# Altium project FluidGuard(Tx).PrjPcb (part 1 of 2)
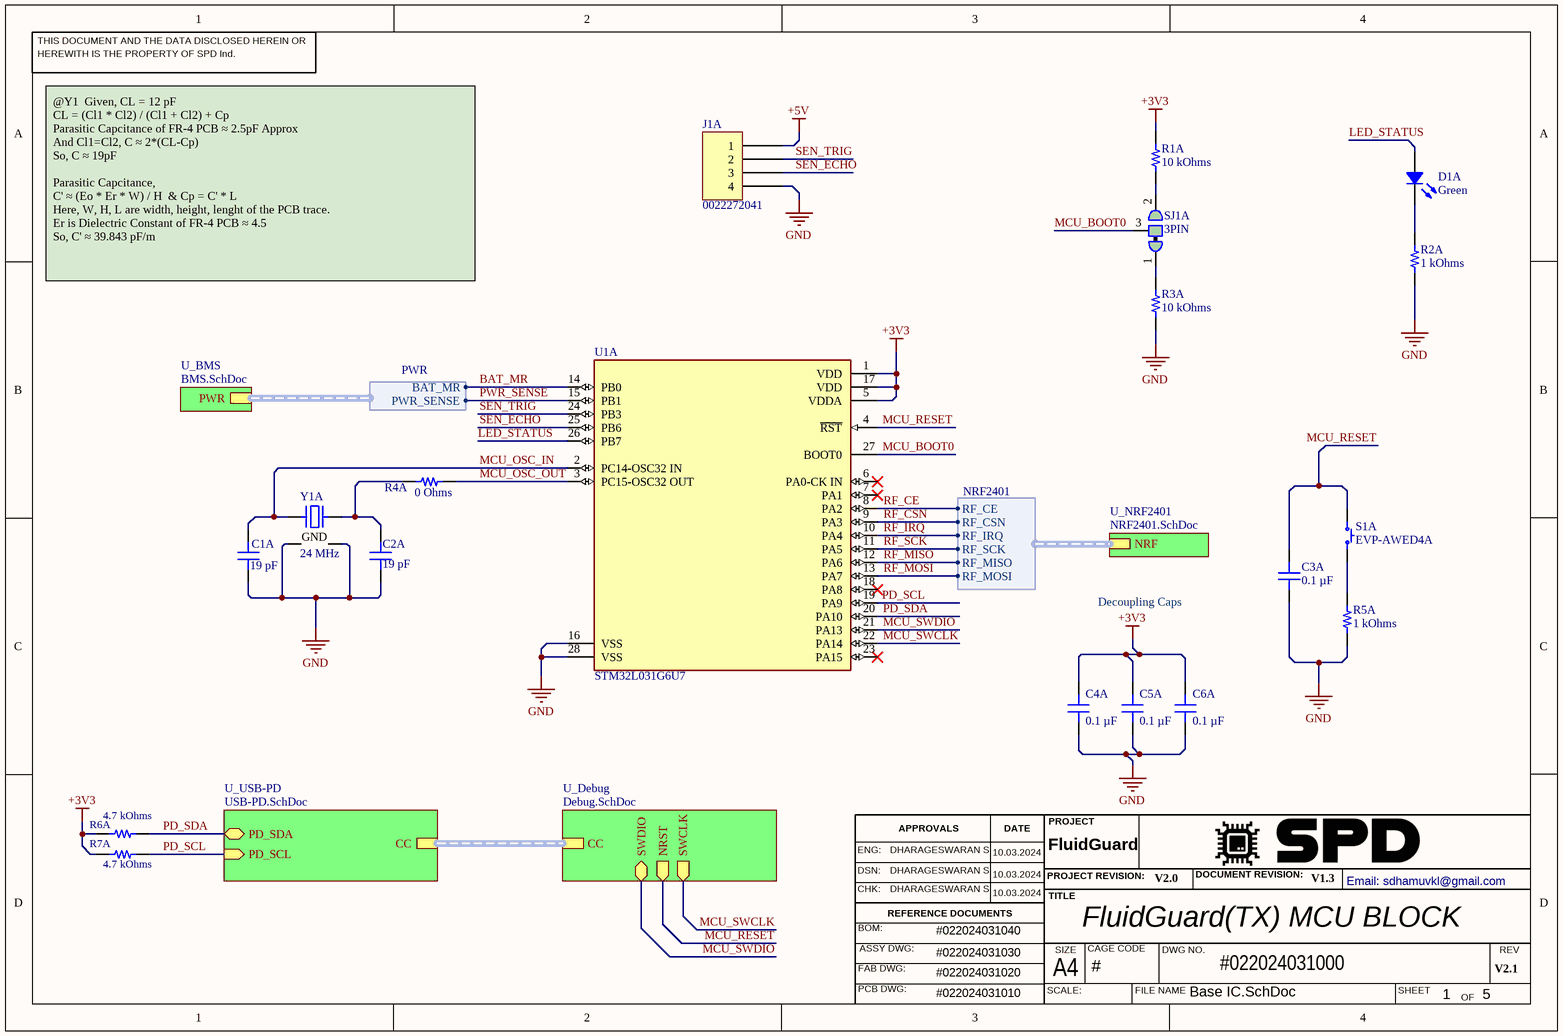
[diagram p0: Base IC.SchDoc]
CAGE_CODE: #; Date: 10.03.2024; DOC_NO_ASSY_DWG: #022024031030; DOC_NO_BOM: #022024031040; DOC_NO_FAB_DWG: #022024031020; DOC_NO_SCH_DWG: #022024031000; DocumentRevision: V1.3; PCB_DWG_NO: #022024031010; Project: FluidGuard; ProjectRevision: V2.0; Revision: V2.1
5 sheets, 115 parts. Net scope: hierarchical (ports join the sheet entries above them; power ports are global).
Board file: FluidGuard(TX).PcbDoc
Sheets:
  Base IC.SchDoc
    U_Debug = Debug.SchDoc
    U_NRF2401 = NRF2401.SchDoc
    U_USB-PD = USB-PD.SchDoc
    U_BMS = BMS.SchDoc

## Sheet Base IC.SchDoc: FluidGuard(TX) MCU BLOCK
size A4; SheetNumber: 1; SheetTotal: 5

### Parts
C1A  19 pF  [CAP 0402_1005]
C2A  19 pF  [CAP 0402_1005]
C3A  0.1 µF  [CAP 0402_1005]
C4A  0.1 µF  [CAP 0402_1005]
C5A  0.1 µF  [CAP 0402_1005]
C6A  0.1 µF  [CAP 0402_1005]
D1A  Green  [LED 0402_1005 GREEN]
J1A  0022272041  [MOLEX KK 0022272041]
R1A  10 kOhms  [RES 0402_1005]
R2A  1 kOhms  [RES 0402_1005]
R3A  10 kOhms  [RES 0402_1005]
R4A  0 Ohms  [RES 0402_1005]
R5A  1 kOhms  [RES 0402_1005]
R6A  4.7 kOhms  [RES 0402_1005]
R7A  4.7 kOhms  [RES 0402_1005]
S1A  EVP-AWED4A  [PANASONIC EVPAW]
SJ1A  3PIN  [Rounded Jumper Joint 3-pin]
U1A  STM32L031G6U7  [FP-UFQFPN28-A0B0-MFG]
Y1A  24 MHz  [EPSON TSX-3225]

### Sub-sheets
U_BMS = BMS.SchDoc: PWR (harness PWR)
U_Debug = Debug.SchDoc: SWDIO (bidir), SWCLK (out), NRST (out), CC (harness CC)
U_NRF2401 = NRF2401.SchDoc: NRF (harness NRF2401)
U_USB-PD = USB-PD.SchDoc: PD_SDA (bidir), PD_SCL (in), CC (harness CC)

### Harnesses
NRF2401: RF_CE, RF_CSN, RF_IRQ, RF_SCK, RF_MISO, RF_MOSI
PWR: BAT_MR, PWR_SENSE

### Nets
+3V3: C4A.2 C5A.2 C6A.2 R1A.2 R6A.2 R7A.2 U1A.1(VDD) U1A.5(VDDA) U1A.17(VDD)
+5V: J1A.1
GND: C1A.1 C2A.1 C3A.1 C4A.1 C5A.1 C6A.1 J1A.4 R2A.1 R3A.1 R5A.1 U1A.16(VSS) U1A.28(VSS) Y1A.2(GND) Y1A.4(GND)
BAT_MR: U1A.14(PB0) ; sheet U_BMS/PWR.BAT_MR
LED_STATUS: D1A.1 U1A.26(PB7)
MCU_BOOT0: SJ1A.3 U1A.27(BOOT0)
MCU_OSC_IN: C1A.2 U1A.2(PC14-OSC32_IN) Y1A.1
MCU_OSC_OUT: R4A.2 U1A.3(PC15-OSC32_OUT)
MCU_RESET: C3A.2 S1A.1 U1A.4(~{RST}) ; sheet U_Debug/NRST
MCU_SWCLK: U1A.22(PA14) ; sheet U_Debug/SWCLK  [project net MCU SWCLK]
MCU_SWDIO: U1A.21(PA13) ; sheet U_Debug/SWDIO  [project net MCU SWDIO]
PD_SCL: R7A.1 U1A.19(PA9) ; sheet U_USB-PD/PD_SCL
PD_SDA: R6A.1 U1A.20(PA10) ; sheet U_USB-PD/PD_SDA
PWR_SENSE: U1A.15(PB1) ; sheet U_BMS/PWR.PWR_SENSE
RF_CE: U1A.8(PA2) ; sheet U_NRF2401/NRF.RF_CE
RF_CSN: U1A.9(PA3) ; sheet U_NRF2401/NRF.RF_CSN
RF_IRQ: U1A.10(PA4) ; sheet U_NRF2401/NRF.RF_IRQ
RF_MISO: U1A.12(PA6) ; sheet U_NRF2401/NRF.RF_MISO
RF_MOSI: U1A.13(PA7) ; sheet U_NRF2401/NRF.RF_MOSI
RF_SCK: U1A.11(PA5) ; sheet U_NRF2401/NRF.RF_SCK
SEN_ECHO: J1A.3 U1A.25(PB6)
SEN_TRIG: J1A.2 U1A.24(PB3)
NetC2A_2: C2A.2 R4A.1 Y1A.3
NetD1A_2: D1A.2 R2A.2
NetR1A_1: R1A.1 SJ1A.2
NetR3A_2: R3A.2 SJ1A.1
NetR5A_2: R5A.2 S1A.2

Not connected (* = marked no-connect by the designer): U1A 6(PA0-CK_IN)* 7(PA1)* 18(PA8)* 23(PA15)*

### Buses and harness runs
harness sheet U_Debug/CC = sheet U_USB-PD/CC

### Notes on the sheet
- @Y1  Given, CL = 12 pF
  CL = (Cl1 * Cl2) / (Cl1 + Cl2) + Cp
  Parasitic Capcitance of FR-4 PCB ≈ 2.5pF Approx
  And Cl1=Cl2, C ≈ 2*(CL-Cp)
  So, C ≈ 19pF
  Parasitic Capcitance,
  C' ≈ (Eo * Er * W) / H  & Cp = C' * L
  Here, W, H, L are width, height, lenght of the PCB trace.
  Er is Dielectric Constant of FR-4 PCB ≈ 4.5
  So, C' ≈ 39.843 pF/m
- Decoupling Caps
- THIS DOCUMENT AND THE DATA DISCLOSED HEREIN OR
- HEREWITH IS THE PROPERTY OF SPD Ind.
- ENG:
- DHARAGESWARAN S
- APPROVALS
- DATE
- PROJECT
- DSN:
- CHK:
- REFERENCE DOCUMENTS
- PROJECT REVISION:
- TITLE
- DOCUMENT REVISION:
- Email: sdhamuvkl@gmail.com <https://github.com/DhamuVkl>
- BOM:
- FAB DWG:
- PCB DWG:
- ASSY DWG:
- SCALE:
- A4
- SIZE
- CAGE CODE
- FILE NAME
- DWG NO.
- SHEET
- REV
- OF

### Library data of the parts
C1A C2A = GJM1555C1H190GB01D: CAP CER 19PF 50VDC 0402 C0G 2%; Manufacturer: Murata Electronics; id: 5279; Temperature Coefficient: C0G, NP0; Voltage - Rated: 50V; Part Number: GJM1555C1H190GB01D; Value: 19 pF; Supplier Part Number 1: 490-GJM1555C1H190GB01DCT-ND; ComponentLink2Description: DigiKey Link; Features: High Q, Low Loss; ComponentLink1URL: https://search.murata.co.jp/Ceramy/image/img/A01X/G101/ENG/GJM1555C1H190GB01-01A.pdf; PartId: 41775; Tolerance: ±2%; Supplier 1: DigiKey; Series: GJM; LastUpdated: 2023-01-03T20:03:22.137; Part Status: Active; Capacitance: 19 pF; Device Package: 0402 (1005 Metric); Thickness (Max): 0.022" (0.55mm); Minimum Order: 1; Packaging: TapeAndReel; Applications: RF, Microwave, High Frequency; Package / Case: 0402 (1005 Metric); ComponentLink1Description: Datasheet; Price: 0.02; ComponentLink2URL: https://www.digikey.com/en/products/detail/murata-electronics/GJM1555C1H190GB01D/16033843; Lifecycle Status: Active; Operating Temperature: -55°C ~ 125°C; Size / Dimension: 0.039" L x 0.020" W (1.00mm x 0.50mm); Mounting Type: Surface Mount, MLCC
C3A C4A C5A C6A = CL05B104KP5VPNC: CAP CER 100NF 10V X7R 0402; Manufacturer: Samsung Electro-Mechanics; id: 7736; Tolerance: ±10%; Part Number: CL05B104KP5VPNC; Value: 0.1 µF; Temperature Coefficient: X7R; Supplier Part Number 1: 1276-CL05B104KP5VPNCCT-ND; ComponentLink2Description: DigiKey Link; ComponentLink1URL: https://mm.digikey.com/Volume0/opasdata/d220001/medias/docus/5458/CL05B104KP5VPNC_Spec.pdf; PartId: 56690; Supplier 1: DigiKey; Series: CL; LastUpdated: 2023-11-05T20:02:55.743; Capacitance: 0.1 µF; Device Package: 0402 (1005 Metric); Ratings: AEC-Q200; Thickness (Max): 0.022" (0.55mm); Voltage - Rated: 10V; Minimum Order: 1; Packaging: TapeAndReel; Applications: Automotive; Package / Case: 0402 (1005 Metric); ComponentLink1Description: Datasheet; Price: 0.01; ComponentLink2URL: https://www.digikey.com/en/products/detail/samsung-electro-mechanics/CL05B104KP5VPNC/20498482; Lifecycle Status: Active; Operating Temperature: -55°C ~ 125°C; Size / Dimension: 0.039" L x 0.020" W (1.00mm x 0.50mm); Mounting Type: Surface Mount, MLCC
D1A = HSMG-C280: LED GREEN DIFFUSED 0402 SMD; Manufacturer: Broadcom Limited; id: 697; Lens Color: White; Wavelength - Peak: 570nm; Lens Style: Rectangle with Flat Top; Viewing Angle: 130°; Lens Size: 1.00mm x 0.50mm; Configuration: Standard; Wavelength - Dominant: 572nm; Voltage - Forward (Vf) (Typ): 2.2V; Current - Test: 20mA; Millicandela Rating: 15mcd; Part Number: HSMG-C280; Supplier Part Number 1: 516-3066-1-ND; Lens Transparency: Diffused; Supplier Device Package: 0402; ComponentLink1Description: Datasheet; Color: Green; ComponentLink2URL: https://www.digikey.com/en/products/detail/broadcom-limited/HSMG-C280/1235358; ComponentLink1URL: https://docs.broadcom.com/docs/AV02-0602EN; Supplier 1: DigiKey; Series: -; Height (Max): 0.40mm; Part Status: Active; ComponentLink2Description: DigiKey Link; Device Package: 0402 (1005 Metric); Packaging: TapeAndReel; Minimum Order: 1; Package / Case: 0402 (1005 Metric); PartId: 697; Lifecycle Status: Active; LastUpdated: 2023-01-02T20:56:26.750; Value: Green; Size / Dimension: 1.00mm L x 0.50mm W; Mounting Type: Surface Mount; Price: 0.08
J1A = 0022272041: CONN HEADER VERT 4POS 2.54MM; Manufacturer: Molex; id: 78; Style: Board to Cable/Wire; Contact Length - Mating: 0.295" (7.49mm); Pitch - Mating: 0.100" (2.54mm); Number Of Positions: 4; Number Of Positions Loaded: All; Shrouding: Shrouded - 1 Wall; Material Flammability Rating: UL94 V-0; Overall Contact Length: 0.560" (14.22mm); Contact Length - Post: 0.140" (3.56mm); Part Number: 0022272041; Supplier Part Number 1: WM4113-ND; Contact Shape: Square; Termination: Solder; ComponentLink1Description: Datasheet; Connector Type: Header; Contact Material: Brass; ComponentLink2URL: http://digikey.com/product-detail/en/molex/0022272041/WM4113-ND/1130579; Contact Finish - Mating: Tin; ComponentLink1URL: https://www.molex.com/pdm_docs/sd/022272041_sd.pdf; Fastening Type: Friction Lock; Supplier 1: DigiKey; Number Of Rows: 1; Series: KK 6410; Part Status: Active; ComponentLink2Description: DigiKey Link; Contact Type: Male Pin; Packaging: Bulk; Insulation Height: 0.461" (11.70mm); Contact Finish - Post: Tin; Contact Finish Thickness - Mating: 100.0µin (2.54µm); Minimum Order: 1; PartId: 78; Lifecycle Status: Active; LastUpdated: 2020-01-12T23:52:05.287; Insulation Color: Natural; Mounting Type: Through Hole; Insulation Material: Polyamide (PA), Nylon; Price: 0.40
R1A R3A = AA0402FR-0710KL: RES SMD 10K OHM 1% 1/16W 0402; Manufacturer: Yageo; id: 10610; Temperature Coefficient: ±150ppm/°C; Power (Watts): 0.063W, 1/16W; Part Number: AA0402FR-0710KL; Height - Seated (Max): 0.015" (0.37mm); Supplier Part Number 1: 13-AA0402FR-0710KLCT-ND; Supplier Device Package: 0402; ComponentLink1Description: Datasheet; ComponentLink2URL: https://www.digikey.com/en/products/detail/yageo/AA0402FR-0710KL/5887729; Features: Anti-Sulfur, Automotive AEC-Q200, Moisture Resistant; ComponentLink1URL: https://www.yageo.com/upload/media/product/productsearch/datasheet/rchip/PYu-AA_51_RoHS_L_3.pdf; Composition: Thick Film; Tolerance: ±1%; Supplier 1: DigiKey; Series: AA; Part Status: Active; ComponentLink2Description: DigiKey Link; Device Package: 0402 (1005 Metric); Packaging: TapeAndReel; Ratings: AEC-Q200; Minimum Order: 1; Package / Case: 0402 (1005 Metric); PartId: 59190; Lifecycle Status: Active; LastUpdated: 2023-01-02T20:20:10.303; Operating Temperature: -55°C ~ 155°C; Number Of Terminations: 2; Value: 10 kOhms; Size / Dimension: 0.039" L x 0.020" W (1.00mm x 0.50mm); Price: 0.01; Resistance: 10 kOhms
R2A R5A = AA0402FR-071KL: RES SMD 1K OHM 1% 1/16W 0402; Manufacturer: Yageo; id: 10598; Temperature Coefficient: ±150ppm/°C; Power (Watts): 0.063W, 1/16W; Part Number: AA0402FR-071KL; Height - Seated (Max): 0.015" (0.37mm); Supplier Part Number 1: 13-AA0402FR-071KLCT-ND; Supplier Device Package: 0402; ComponentLink1Description: Datasheet; ComponentLink2URL: https://www.digikey.com/en/products/detail/yageo/AA0402FR-071KL/5887878; Features: Anti-Sulfur, Automotive AEC-Q200, Moisture Resistant; ComponentLink1URL: https://www.yageo.com/upload/media/product/productsearch/datasheet/rchip/PYu-AA_51_RoHS_L_3.pdf; Composition: Thick Film; Tolerance: ±1%; Supplier 1: DigiKey; Series: AA; Part Status: Active; ComponentLink2Description: DigiKey Link; Device Package: 0402 (1005 Metric); Packaging: TapeAndReel; Ratings: AEC-Q200; Minimum Order: 1; Package / Case: 0402 (1005 Metric); PartId: 59178; Lifecycle Status: Active; LastUpdated: 2023-01-02T20:20:10.210; Operating Temperature: -55°C ~ 155°C; Number Of Terminations: 2; Value: 1 kOhms; Size / Dimension: 0.039" L x 0.020" W (1.00mm x 0.50mm); Price: 0.01; Resistance: 1 kOhms
R4A = AC0402JR-070RL: RES SMD 0 OHM JUMPER 1/16W 0402; Manufacturer: Yageo; id: 9339; Power (Watts): 0.063W, 1/16W; Part Number: AC0402JR-070RL; Height - Seated (Max): 0.015" (0.37mm); Supplier Part Number 1: 311-0.0LBCT-ND; Supplier Device Package: 0402; ComponentLink1Description: Datasheet; ComponentLink2URL: https://www.digikey.com/en/products/detail/yageo/AC0402JR-070RL/2827807; Features: Automotive AEC-Q200, Moisture Resistant; ComponentLink1URL: https://www.yageo.com/upload/media/product/productsearch/datasheet/rchip/PYu-AC_51_RoHS_L_7.pdf; Composition: Thick Film; Tolerance: Jumper; Supplier 1: DigiKey; Series: AC; Part Status: Active; ComponentLink2Description: DigiKey Link; Device Package: 0402 (1005 Metric); Packaging: CutTape; Ratings: AEC-Q200; Minimum Order: 1; Package / Case: 0402 (1005 Metric); PartId: 20617; Lifecycle Status: Active; LastUpdated: 2023-01-02T20:20:32.243; Operating Temperature: -55°C ~ 155°C; Number Of Terminations: 2; Value: 0 Ohms; Size / Dimension: 0.039" L x 0.020" W (1.00mm x 0.50mm); Price: 0.01; Resistance: 0 Ohms
R6A R7A = AC0402FR-074K7L: RES SMD 4.7K OHM 1% 1/16W 0402; Manufacturer: Yageo; id: 4996; Temperature Coefficient: ±100ppm/°C; Power (Watts): 0.063W, 1/16W; Part Number: AC0402FR-074K7L; Height - Seated (Max): 0.015" (0.37mm); Supplier Part Number 1: YAG3497CT-ND; Supplier Device Package: 0402; ComponentLink1Description: Datasheet; ComponentLink2URL: https://www.digikey.com/en/products/detail/yageo/AC0402FR-074K7L/5895396; Features: Automotive AEC-Q200, Moisture Resistant; ComponentLink1URL: https://www.yageo.com/upload/media/product/productsearch/datasheet/rchip/PYu-AC_51_RoHS_L_7.pdf; Composition: Thick Film; Tolerance: ±1%; Supplier 1: DigiKey; Series: AC; Part Status: Active; ComponentLink2Description: DigiKey Link; Device Package: 0402 (1005 Metric); Packaging: CutTape; Ratings: AEC-Q200; Minimum Order: 1; Package / Case: 0402 (1005 Metric); PartId: 12051; Lifecycle Status: Active; LastUpdated: 2023-01-02T20:21:09.847; Operating Temperature: -55°C ~ 155°C; Number Of Terminations: 2; Value: 4.7 kOhms; Size / Dimension: 0.039" L x 0.020" W (1.00mm x 0.50mm); Price: 0.01; Resistance: 4.7 kOhms
S1A = EVP-AWED4A: 3.0MM X 2.0MM / 3.3N / 0.15MM ST; Manufacturer: Panasonic Electronic Components; id: 5; Switch Function: Off-Mom; Contact Rating @ Voltage: 0.02A @ 15VDC; Outline: 3.00mm x 2.00mm; Actuator Height Off Pcb, Vertical: 0.60mm; Ingress Protection: IP67 - Dust Tight, Waterproof; Actuator Orientation: Top Actuated; Actuator Type: Standard; Illumination: Non-Illuminated; Operating Force: 330gf; Circuit: SPST-NO; Part Number: EVP-AWED4A; Supplier Part Number 1: P123440CT-ND; ComponentLink1Description: Datasheet; ComponentLink2URL: https://www.digikey.com/en/products/detail/panasonic-electronic-components/EVP-AWED4A/8568275; ComponentLink1URL: https://industrial.panasonic.com/ac/cdn/e/control/switch/light-touch/catalog/sw_lt_eng_3020s.pdf; Supplier 1: DigiKey; Series: EVPAW; Part Status: Active; ComponentLink2Description: DigiKey Link; Packaging: TapeAndReel; Minimum Order: 1; Lifecycle Status: Active; LastUpdated: 2023-01-02T21:07:29.980; Termination Style: SMD (SMT) Tab; Operating Temperature: -40°C ~ 85°C; Mounting Type: Surface Mount; Price: 0.16
SJ1A = Rounded Jumper Joint 3-pin
U1A = CMP-12105-000084-1: IC MCU 32BIT 32KB FLASH 28UFQFPN; Oscillator Type: Internal; Core Architecture: ARM; Peripherals: Brown-out Detect/Reset; Interface: I2C; Watchdog Timer: Yes; Max Power Dissipation: 167mW; Max Frequency: 32MHz; Operating Supply Voltage: 3.3V; Number of Timers/Counters: 4; Max Supply Voltage: 3.6V; RAM Size: 1KB; Number of Programmable I/O: 21; Min Supply Voltage: 1.8V; Lead Free: Lead Free; Mount: Surface Mount; Min Operating Temperature: -40°C; Frequency: 32MHz; Max Operating Temperature: 105°C; Number of Pins: 28; Memory Type: FLASH; Number of I/Os: 21; Memory Size: 32KB
Y1A = TSX-3225 24.0000MF15X-AC3: CRYSTAL 24.0000MHZ 9PF SMD; Manufacturer: EPSON; id: 441; Frequency Tolerance: ±10ppm; Frequency Stability: ±15ppm; Operating Mode: Fundamental; Esr (Equivalent Series Resistance): 40 Ohms; Part Number: TSX-3225 24.0000MF15X-AC3; Height - Seated (Max): 0.024" (0.60mm); Supplier Part Number 1: SER3635CT-ND; ComponentLink1Description: Datasheet; ComponentLink2URL: https://www.digikey.com/en/products/detail/epson/TSX-3225-24-0000MF15X-AC3/1825444; ComponentLink1URL: https://support.epson.biz/td/api/doc_check.php?dl=brief_TSX-3225&lang=en; Supplier 1: DigiKey; Frequency: 24 MHz; Series: TSX-3225; Part Status: Active; Type: MHz Crystal; ComponentLink2Description: DigiKey Link; Packaging: TapeAndReel; Minimum Order: 1; Package / Case: 4-SMD, No Lead; PartId: 441; Lifecycle Status: Active; LastUpdated: 2023-01-02T20:58:19.840; Operating Temperature: -40°C ~ 85°C; Value: 24 MHz; Size / Dimension: 0.126" L x 0.098" W (3.20mm x 2.50mm); Mounting Type: Surface Mount; Price: 0.44; Load Capacitance: 9pF

## Sheet Debug.SchDoc: DEBUG PORT
size A4; SheetNumber: 5; SheetTotal: 5; DOC_NO_SCH_DWG: #022024031004
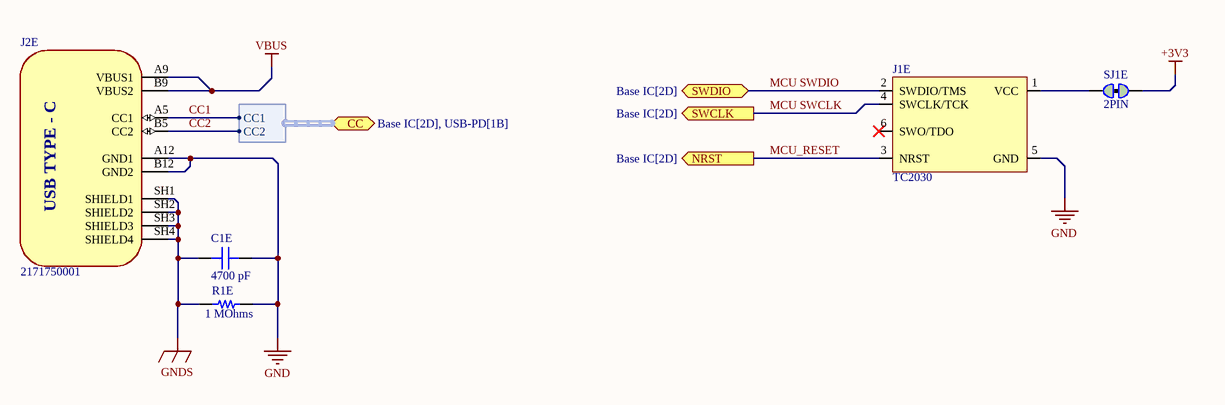
[diagram p1: Debug.SchDoc]

### Parts
C1E  4700 pF  [CAP 0402_1005]
J1E  TC2030  [TC2030-FP]  (no BOM)
J2E  2171750001  [MOLEX_2171750001]
R1E  1 MOhms  [RES 0402_1005]
SJ1E  2PIN  [Rounded Jumper Joint]

### Ports
CC (bidir, harness CC, see Base IC[2D], USB-PD[1B]), NRST (out, see Base IC[2D]), SWCLK (out, see Base IC[2D]), SWDIO (bidir, see Base IC[2D])

### Harnesses
CC: CC1, CC2

### Nets
+3V3: SJ1E.2
GND: C1E.2 J1E.5(GND) J2E.A12(GND1) J2E.B12(GND2) R1E.2
GNDS: C1E.1 J2E.SH1(SHIELD1) J2E.SH2(SHIELD2) J2E.SH3(SHIELD3) J2E.SH4(SHIELD4) R1E.1
VBUS: J2E.A9(VBUS1) J2E.B9(VBUS2)
CC1: J2E.A5(CC1) ; port CC.CC1
CC2: J2E.B5(CC2) ; port CC.CC2
MCU SWCLK: J1E.4(SWCLK/TCK) ; port SWCLK
MCU SWDIO: J1E.2(SWDIO/TMS) ; port SWDIO
MCU_RESET: J1E.3(NRST) ; port NRST
NetJ1E_1: J1E.1(VCC) SJ1E.1

Not connected (* = marked no-connect by the designer): J1E 6(SWO/TDO)*

### Notes on the sheet
- THIS DOCUMENT AND THE DATA DISCLOSED HEREIN OR
- HEREWITH IS THE PROPERTY OF SPD Ind.
- ENG:
- DHARAGESWARAN S
- APPROVALS
- DATE
- PROJECT
- DSN:
- CHK:
- REFERENCE DOCUMENTS
- PROJECT REVISION:
- TITLE
- DOCUMENT REVISION:
- Email: sdhamuvkl@gmail.com <https://github.com/DhamuVkl>
- BOM:
- FAB DWG:
- PCB DWG:
- ASSY DWG:
- SCALE:
- A4
- SIZE
- CAGE CODE
- FILE NAME
- DWG NO.
- SHEET
- REV
- OF
- (in symbol 2171750001) USB TYPE - C

### Library data of the parts
C1E = C0402C472K4RECAUTO: CAP CER 0402 4.7NF 16V X7R 10%; Manufacturer: KEMET; id: 3032; Part Number: C0402C472K4RECAUTO; Value: 4700 pF; Temperature Coefficient: X7R; Supplier Part Number 1: 399-17875-1-ND; ComponentLink2Description: DigiKey Link; ComponentLink1URL: https://api.kemet.com/component-edge/download/datasheet/C0402C472K4RECAUTO.pdf; PartId: 12122; Tolerance: ±10%; Supplier 1: DigiKey; Series: ESD SMD Auto X7R; LastUpdated: 2023-01-03T20:03:46.940; Part Status: Active; Capacitance: 4700 pF; Device Package: 0402 (1005 Metric); Ratings: AEC-Q200; Thickness (Max): 0.022" (0.55mm); Voltage - Rated: 16V; Minimum Order: 1; Packaging: TapeAndReel; Applications: Automotive, ESD Protection; Package / Case: 0402 (1005 Metric); ComponentLink1Description: Datasheet; Price: 0.01; ComponentLink2URL: https://www.digikey.com/en/products/detail/kemet/C0402C472K4RECAUTO/8640469; Lifecycle Status: Active; Operating Temperature: -55°C ~ 125°C; Size / Dimension: 0.039" L x 0.020" W (1.00mm x 0.50mm); Mounting Type: Surface Mount, MLCC
J1E = TC2030: Tag-Connect No-Solder SWD Debug Connector DO NOT PLACE; Manufacturer: Tag-Connect; Manufacturer Part Number: TC2030; Supplier 1: Digikey; Supplier Part Number 1: TC2030-MCP-NLTC-ND
J2E = 2171750001: USB-C (USB TYPE-C) USB 2.0 Receptacle Connector 24 (6+18 Dummy) Position Surface Mount, Right Angle; Through Hole; MF: Molex; SnapEDA_Link: https://www.snapeda.com/parts/2171750001/Molex/view-part/?ref=snap; Package: None; Value: *; MP: 2171750001; Check_prices: https://www.snapeda.com/parts/2171750001/Molex/view-part/?ref=eda
R1E = AC0402FR-071ML: RES SMD 1M OHM 1% 1/16W 0402; Manufacturer: Yageo; id: 4991; Temperature Coefficient: ±100ppm/°C; Power (Watts): 0.063W, 1/16W; Part Number: AC0402FR-071ML; Height - Seated (Max): 0.015" (0.37mm); Supplier Part Number 1: YAG3450CT-ND; Supplier Device Package: 0402; ComponentLink1Description: Datasheet; ComponentLink2URL: https://www.digikey.com/en/products/detail/yageo/AC0402FR-071ML/5895164; Features: Automotive AEC-Q200, Moisture Resistant; ComponentLink1URL: https://www.yageo.com/upload/media/product/productsearch/datasheet/rchip/PYu-AC_51_RoHS_L_7.pdf; Composition: Thick Film; Tolerance: ±1%; Supplier 1: DigiKey; Series: AC; Part Status: Active; ComponentLink2Description: DigiKey Link; Device Package: 0402 (1005 Metric); Packaging: CutTape; Ratings: AEC-Q200; Minimum Order: 1; Package / Case: 0402 (1005 Metric); PartId: 12043; Lifecycle Status: Active; LastUpdated: 2023-01-02T20:21:09.883; Operating Temperature: -55°C ~ 155°C; Number Of Terminations: 2; Value: 1 MOhms; Size / Dimension: 0.039" L x 0.020" W (1.00mm x 0.50mm); Price: 0.01; Resistance: 1 MOhms
SJ1E = Rounded Jumper Joint

## Sheet NRF2401.SchDoc: NRF24L01-TX
size A4; SheetNumber: 3; SheetTotal: 5; DOC_NO_SCH_DWG: #022024031002
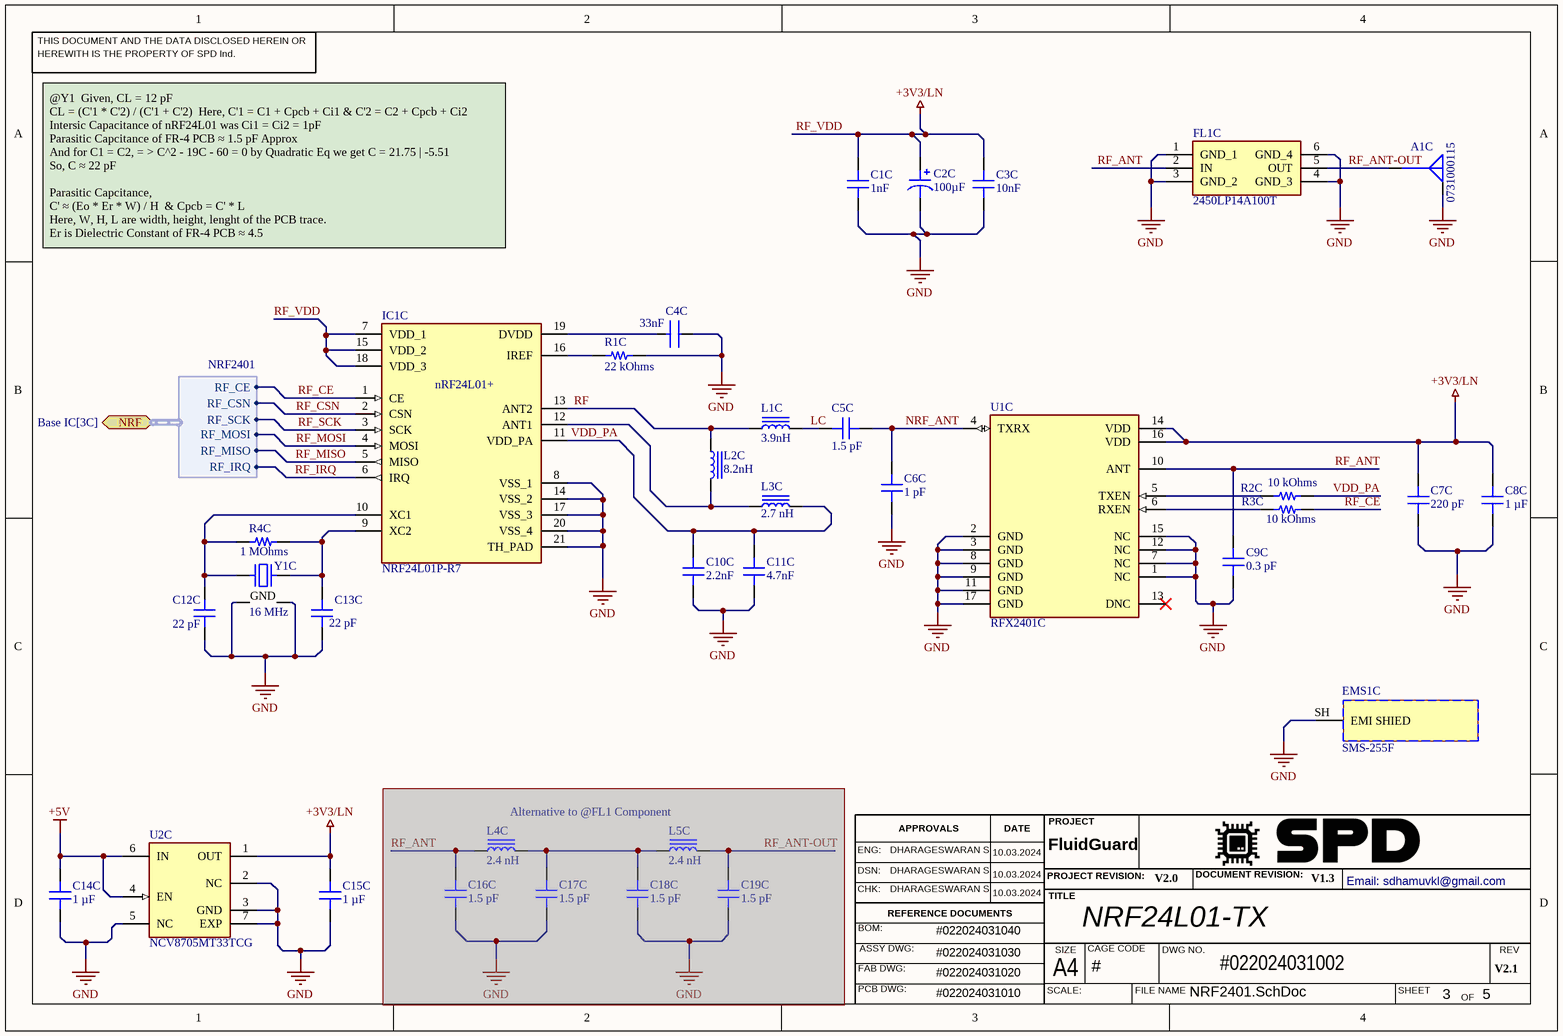
[diagram p2: NRF2401.SchDoc]

### Parts
A1C  0731000115  [MOLEX SD-73100-0115]
C1C  1nF  [CAP 0402_1005]
C2C  100µF  [CAP POL 1411_3528]
C3C  10nF  [CAP 0402_1005]
C4C  Capacitance: 33nF  [FP-CL101-IPC_C]  (hidden comment: CL05B333KO5NNNC)
C5C  1.5 pF  [CAP 0402_1005]
C6C  1 pF  [CAP 0402_1005]
C7C  220 pF  [CAP 0402_1005]
C8C  1 µF  [CAP 0402_1005]
C9C  0.3 pF  [CAP 0402_1005]
C10C  2.2nF  [CAP 0402_1005]
C11C  4.7nF  [CAP 0402_1005]
C12C  22 pF  [CAP 0402_1005]
C13C  22 pF  [CAP 0402_1005]
C14C  1 µF  [CAP 0402_1005]
C15C  1 µF  [CAP 0402_1005]
C16C  1.5 pF  [CAP 0402_1005]  (masked out: inside a compile mask, not in the netlist)
C17C  1.5 pF  [CAP 0402_1005]  (masked out: inside a compile mask, not in the netlist)
C18C  1.5 pF  [CAP 0402_1005]  (masked out: inside a compile mask, not in the netlist)
C19C  1.5 pF  [CAP 0402_1005]  (masked out: inside a compile mask, not in the netlist)
EMS1C  SMS-255F  [LEADERTECH_SMS-255F]
FL1C  2450LP14A100T  [2450LP14A100T]
IC1C  NRF24L01P-R7  [QFN50P400X400X95-21N-D]
L1C  3.9nH  [IND 0603_1608 RF WW]
L2C  8.2nH  [IND 0603_1608 RF WW]
L3C  2.7 nH  [IND 0402_1005 RF WW]
L4C  2.4 nH  [IND 0402_1005 RF WW]  (masked out: inside a compile mask, not in the netlist)
L5C  2.4 nH  [IND 0402_1005 RF WW]  (masked out: inside a compile mask, not in the netlist)
R1C  22 kOhms  [RES 0402_1005]
R2C  10 kOhms  [RES 0402_1005]
R3C  10 kOhms  [RES 0402_1005]
R4C  1 MOhms  [RES 0402_1005]
U1C  RFX2401C  [RFX2401C_SKY]
U2C  NCV8705MT33TCG  [FP-511BR-MFG]
Y1C  16 MHz  [NDK NX2520SA]

### Ports
NRF (bidir, harness NRF2401, see Base IC[3C])

### Harnesses
NRF2401: RF_CE, RF_CSN, RF_SCK, RF_MISO, RF_MOSI, RF_IRQ

### Nets
+5V: C14C.2 U2C.4(EN) U2C.6(IN)
GND: A1C.G C1C.1 C2C.2 C3C.1 C4C.2 C6C.1 C7C.1 C8C.2 C9C.1 C10C.1 C11C.1 C12C.1 C13C.1 C14C.1 C15C.1 EMS1C.SH(EMI_SHIED) FL1C.1(GND_1) FL1C.3(GND_2) FL1C.4(GND_3) FL1C.6(GND_4) IC1C.8(VSS_1) IC1C.14(VSS_2) IC1C.17(VSS_3) IC1C.20(VSS_4) IC1C.21(TH_PAD) R1C.1 U1C.1(NC) U1C.2(GND) U1C.3(GND) U1C.7(NC) U1C.8(GND) U1C.9(GND) U1C.11(GND) U1C.12(NC) U1C.15(NC) U1C.17(GND) U2C.2(NC) U2C.3(GND) U2C.5(NC) U2C.7(EXP) Y1C.2(GND) Y1C.4(GND)
RF_VDD: C1C.2 C2C.1 C3C.2 C7C.2 C8C.1 C15C.2 IC1C.7(VDD_1) IC1C.15(VDD_2) IC1C.18(VDD_3) U1C.14(VDD) U1C.16(VDD) U2C.1(OUT)  [also labelled +3V3/LN]
LC: C5C.1 L1C.2
NRF_ANT: C5C.2 C6C.2 U1C.4(TXRX)
RF: IC1C.13(ANT2) L1C.1 L2C.1
RF_ANT: C9C.2 FL1C.2(IN) U1C.10(ANT)
RF_ANT-OUT: A1C.S FL1C.5(OUT)
RF_CE: IC1C.1(CE) R3C.2 ; port NRF.RF_CE
RF_CSN: IC1C.2(CSN) ; port NRF.RF_CSN
RF_IRQ: IC1C.6(IRQ) ; port NRF.RF_IRQ
RF_MISO: IC1C.5(MISO) ; port NRF.RF_MISO
RF_MOSI: IC1C.4(MOSI) ; port NRF.RF_MOSI
RF_SCK: IC1C.3(SCK) ; port NRF.RF_SCK
VDD_PA: C10C.2 C11C.2 IC1C.11(VDD_PA) L3C.2 R2C.2
NetC4C_1: C4C.1 IC1C.19(DVDD)
NetC12C_2: C12C.2 IC1C.10(XC1) R4C.1 Y1C.1
NetC13C_2: C13C.2 IC1C.9(XC2) R4C.2 Y1C.3
NetIC1C_12: IC1C.12(ANT1) L2C.2 L3C.1
NetIC1C_16: IC1C.16(IREF) R1C.2
NetR2C_1: R2C.1 U1C.5(TXEN)
NetR3C_1: R3C.1 U1C.6(RXEN)

Not connected (* = marked no-connect by the designer): U1C 13(DNC)*

### Notes on the sheet
- @Y1  Given, CL = 12 pF
  CL = (C'1 * C'2) / (C'1 + C'2)  Here, C'1 = C1 + Cpcb + Ci1 & C'2 = C2 + Cpcb + Ci2
  Intersic Capacitance of nRF24L01 was Ci1 = Ci2 = 1pF
  Parasitic Capcitance of FR-4 PCB ≈ 1.5 pF Approx
  And for C1 = C2, = > C^2 - 19C - 60 = 0 by Quadratic Eq we get C = 21.75 | -5.51
  So, C ≈ 22 pF
  Parasitic Capcitance,
  C' ≈ (Eo * Er * W) / H  & Cpcb = C' * L
  Here, W, H, L are width, height, lenght of the PCB trace.
  Er is Dielectric Constant of FR-4 PCB ≈ 4.5
  So, C' ≈ 39.843 pF/m
- Alternative to @FL1 Component
- THIS DOCUMENT AND THE DATA DISCLOSED HEREIN OR
- HEREWITH IS THE PROPERTY OF SPD Ind.
- ENG:
- DHARAGESWARAN S
- APPROVALS
- DATE
- PROJECT
- DSN:
- CHK:
- REFERENCE DOCUMENTS
- PROJECT REVISION:
- TITLE
- DOCUMENT REVISION:
- Email: sdhamuvkl@gmail.com <https://github.com/DhamuVkl>
- BOM:
- FAB DWG:
- PCB DWG:
- ASSY DWG:
- SCALE:
- A4
- SIZE
- CAGE CODE
- FILE NAME
- DWG NO.
- SHEET
- REV
- OF
- (in symbol NRF24L01P-R7) nRF24L01+

### Library data of the parts
A1C = 0731000115: CONN SMA RCPT R/A 50 OHM PCB; Manufacturer: Molex; id: 4; Contact Termination: Solder; Connector Type: Receptacle, Female Socket; Number Of Ports: 1; Impedance: 50Ohm; Frequency - Max: 18 GHz; Part Number: 0731000115; Housing Color: Silver; Supplier Part Number 1: WM8552-ND; ComponentLink1Description: Datasheet; ComponentLink2URL: https://www.digikey.com/en/products/detail/molex/0731000115/3044674; ComponentLink1URL: https://www.molex.com/pdm_docs/sd/731000115_sd.pdf; Fastening Type: Threaded; Supplier 1: DigiKey; Series: 73100; Part Status: Active; Shield Termination: Solder; ComponentLink2Description: DigiKey Link; Packaging: Tray; Minimum Order: 1; Lifecycle Status: Active; LastUpdated: 2022-06-29T18:03:04.613; Connector Style: SMA; Mounting Type: Through Hole, Right Angle; Price: 2.95
C1C = C0402C102J3RECAUTO: CAP CER 0402 1NF 25V X7R 5%; Manufacturer: KEMET; id: 4189; Value: 1000 pF; Part Number: C0402C102J3RECAUTO; Temperature Coefficient: X7R; Supplier Part Number 1: 399-C0402C102J3RECAUTOCT-ND; ComponentLink2Description: DigiKey Link; ComponentLink1URL: https://api.kemet.com/component-edge/download/datasheet/C0402C102J3RECAUTO.pdf; PartId: 33620; Tolerance: ±5%; Supplier 1: DigiKey; Series: ESD SMD Auto X7R; LastUpdated: 2023-01-03T20:03:34.767; Part Status: Active; Capacitance: 1000 pF; Device Package: 0402 (1005 Metric); Ratings: AEC-Q200; Thickness (Max): 0.022" (0.55mm); Voltage - Rated: 25V; Minimum Order: 1; Packaging: TapeAndReel; Applications: Automotive, ESD Protection; Package / Case: 0402 (1005 Metric); ComponentLink1Description: Datasheet; Price: 0.02; ComponentLink2URL: https://www.digikey.com/en/products/detail/kemet/C0402C102J3RECAUTO/8646431; Lifecycle Status: Active; Operating Temperature: -55°C ~ 125°C; Size / Dimension: 0.039" L x 0.020" W (1.00mm x 0.50mm); Mounting Type: Surface Mount, MLCC
C2C = TPSB107K006R0250: CAP TANT 100UF 10% 6.3V 1411; Manufacturer: AVX Corporation; Manufacturer Size Code: B; id: 70; Type: Molded; Esr (Equivalent Series Resistance): 250mOhm; Part Number: TPSB107K006R0250; Value: 100µF; Height - Seated (Max): 0.083" (2.10mm); Supplier Part Number 1: 478-3080-1-ND; ComponentLink2Description: DigiKey Link; Features: General Purpose; ComponentLink1URL: http://datasheets.avx.com/TPS.pdf; PartId: 70; Tolerance: ±10%; Supplier 1: DigiKey; Series: TPS; LastUpdated: 2020-09-02T01:15:45.860; Part Status: Active; Capacitance: 100µF; Voltage - Rated: 6.3V; Minimum Order: 1; Packaging: TapeAndReel; Package / Case: 1411 (3528 Metric), 1210; ComponentLink1Description: Datasheet; Price: 0.13; ComponentLink2URL: http://digikey.com/product-detail/en/avx-corporation/TPSB107K006R0250/478-3080-1-ND/809593; Lifecycle Status: Active; Operating Temperature: -55°C ~ 125°C; Size / Dimension: 0.138" L x 0.110" W (3.50mm x 2.80mm); Mounting Type: Surface Mount
C3C = C0402C103J5RECAUTO: CAP CER 0402 10NF 50V X7R 5%; Manufacturer: KEMET; id: 3927; Value: 10000 pF; Part Number: C0402C103J5RECAUTO; Temperature Coefficient: X7R; Supplier Part Number 1: 399-C0402C103J5RECAUTOCT-ND; ComponentLink2Description: DigiKey Link; ComponentLink1URL: https://api.kemet.com/component-edge/download/datasheet/C0402C103J5RECAUTO.pdf; PartId: 33153; Tolerance: ±5%; Supplier 1: DigiKey; Series: ESD SMD Auto X7R; LastUpdated: 2023-01-03T20:03:32.240; Part Status: Active; Capacitance: 10000 pF; Device Package: 0402 (1005 Metric); Ratings: AEC-Q200; Thickness (Max): 0.022" (0.55mm); Voltage - Rated: 50V; Minimum Order: 1; Packaging: TapeAndReel; Applications: Automotive, ESD Protection; Package / Case: 0402 (1005 Metric); ComponentLink1Description: Datasheet; Price: 0.02; ComponentLink2URL: https://www.digikey.com/en/products/detail/kemet/C0402C103J5RECAUTO/8646448; Lifecycle Status: Active; Operating Temperature: -55°C ~ 125°C; Size / Dimension: 0.039" L x 0.020" W (1.00mm x 0.50mm); Mounting Type: Surface Mount, MLCC
C4C = CMP-13271-004220-1: Cap Ceramic 33nF 16V X7R ±10% SMD 0402 +125°C Paper T/R; Dielectric: X7R; Mount: Surface Mount; Depth: 0.5mm; Case/Package: 0402; Packaging: Tape and Reel; Height: 0.5mm; Voltage: 16V; Radiation Hardening: No; Length: 1mm; Case Code (Imperial): 0402; Tolerance: 10%; Max Operating Temperature: 125°C; Width: 0.02inch; Voltage Rating (DC): 16V; Case Code (Metric): 1005; Lead Free: Lead Free; Voltage Rating: 16V; Thickness: 0.022inch; Min Operating Temperature: -55°C
C5C C16C C17C C18C C19C = GJM1555C1H1R5WB01D: CAP CER 1.5PF 50V C0G/NP0 0402; Manufacturer: Murata Electronics; id: 1437; Temperature Coefficient: C0G, NP0; Tolerance: ±0.05pF; Part Number: GJM1555C1H1R5WB01D; Value: 1.5 pF; Supplier Part Number 1: 490-11199-1-ND; ComponentLink2Description: DigiKey Link; Features: High Q, Low Loss; ComponentLink1URL: https://search.murata.co.jp/Ceramy/image/img/A01X/G101/ENG/GJM1555C1H1R5WB01-01.pdf; PartId: 5918; Supplier 1: DigiKey; Series: GJM; LastUpdated: 2023-01-03T20:04:06.813; Part Status: Active; Capacitance: 1.5 pF; Device Package: 0402 (1005 Metric); Thickness (Max): 0.022" (0.55mm); Voltage - Rated: 50V; Minimum Order: 1; Packaging: TapeAndReel; Applications: RF, Microwave, High Frequency; Package / Case: 0402 (1005 Metric); ComponentLink1Description: Datasheet; Price: 0.02; ComponentLink2URL: https://www.digikey.com/en/products/detail/murata-electronics/GJM1555C1H1R5WB01D/2592890; Lifecycle Status: Active; Operating Temperature: -55°C ~ 125°C; Size / Dimension: 0.039" L x 0.020" W (1.00mm x 0.50mm); Mounting Type: Surface Mount, MLCC
C6C = VJ0402A1R0BXQPW1BC: CAP CER 1PF 10V C0G/NP0 0402; Manufacturer: Vishay Vitramon; id: 3394; Temperature Coefficient: C0G, NP0; Tolerance: ±0.1pF; Part Number: VJ0402A1R0BXQPW1BC; Value: 1 pF; Supplier Part Number 1: 720-VJ0402A1R0BXQPW1BCCT-ND; ComponentLink2Description: DigiKey Link; ComponentLink1URL: https://www.vishay.com/docs/28548/vjw1bcbascomseries.pdf; PartId: 26167; Supplier 1: DigiKey; Series: VJ; LastUpdated: 2023-01-03T20:03:41.757; Part Status: Active; Capacitance: 1 pF; Device Package: 0402 (1005 Metric); Thickness (Max): 0.022" (0.55mm); Voltage - Rated: 10V; Minimum Order: 1; Packaging: TapeAndReel; Applications: General Purpose; Package / Case: 0402 (1005 Metric); ComponentLink1Description: Datasheet; Price: 0.01; ComponentLink2URL: https://www.digikey.com/en/products/detail/vishay-vitramon/VJ0402A1R0BXQPW1BC/8301012; Lifecycle Status: Active; Operating Temperature: -55°C ~ 125°C; Size / Dimension: 0.039" L x 0.020" W (1.00mm x 0.50mm); Mounting Type: Surface Mount, MLCC
C7C = KGM05ACG1H221FH: CAP CER 220PF 50V NP0 0402; Manufacturer: KYOCERA AVX; id: 6699; Temperature Coefficient: C0G, NP0; Tolerance: ±1%; Part Number: KGM05ACG1H221FH; Value: 220 pF; Supplier Part Number 1: 478-KGM05ACG1H221FHCT-ND; ComponentLink2Description: DigiKey Link; ComponentLink1URL: https://datasheets.kyocera-avx.com/C0GNP0-Dielectric.pdf; PartId: 50371; Supplier 1: DigiKey; Series: -; LastUpdated: 2023-05-20T19:03:18.857; Part Status: Active; Capacitance: 220 pF; Device Package: 0402 (1005 Metric); Thickness (Max): 0.022" (0.56mm); Voltage - Rated: 50V; Minimum Order: 1; Packaging: TapeAndReel; Applications: General Purpose; Package / Case: 0402 (1005 Metric); ComponentLink1Description: Datasheet; Price: 0.05; ComponentLink2URL: https://www.digikey.com/en/products/detail/kyocera-avx/KGM05ACG1H221FH/1597432; Lifecycle Status: Active; Operating Temperature: -55°C ~ 125°C; Size / Dimension: 0.039" L x 0.020" W (1.00mm x 0.50mm); Mounting Type: Surface Mount, MLCC
C8C C14C C15C = GRM155C81C105KE11D: CAP CER 1UF 16V X6S 0402; Manufacturer: Murata Electronics; id: 824; Tolerance: ±10%; Part Number: GRM155C81C105KE11D; Value: 1 µF; Temperature Coefficient: X6S; Supplier Part Number 1: 490-12700-1-ND; ComponentLink2Description: DigiKey Link; ComponentLink1URL: https://search.murata.co.jp/Ceramy/image/img/A01X/G101/ENG/GRM155C81C105KE11-01.pdf; PartId: 3683; Supplier 1: DigiKey; Series: GRM; LastUpdated: 2023-01-03T20:04:13.167; Part Status: Active; Capacitance: 1 µF; Device Package: 0402 (1005 Metric); Thickness (Max): 0.024" (0.60mm); Voltage - Rated: 16V; Minimum Order: 1; Packaging: TapeAndReel; Applications: General Purpose; Package / Case: 0402 (1005 Metric); ComponentLink1Description: Datasheet; Price: 0.01; ComponentLink2URL: https://www.digikey.com/en/products/detail/murata-electronics/GRM155C81C105KE11D/4905091; Lifecycle Status: Active; Operating Temperature: -55°C ~ 105°C; Size / Dimension: 0.039" L x 0.020" W (1.00mm x 0.50mm); Mounting Type: Surface Mount, MLCC
C9C = QSCF500Q0R3A1GV001T: CAP CER 0.3PF 50V C0G/NP0 0402; Manufacturer: Johanson Technology Inc.; id: 6223; Temperature Coefficient: C0G, NP0; Tolerance: ±0.05pF; Part Number: QSCF500Q0R3A1GV001T; Value: 0.3 pF; Supplier Part Number 1: 712-QSCF500Q0R3A1GV001TCT-ND; ComponentLink2Description: DigiKey Link; Features: High Q, Low Loss, Ultra Low ESR; ComponentLink1URL: https://www.johansontechnology.com/downloads/catalog/johanson-technology-multi-layer-high-q-capacitors.pdf; PartId: 47766; Supplier 1: DigiKey; Series: S; LastUpdated: 2023-04-03T19:03:42.407; Part Status: Active; Capacitance: 0.3 pF; Device Package: 0402 (1005 Metric); Thickness (Max): 0.024" (0.61mm); Voltage - Rated: 50V; Minimum Order: 1; Packaging: TapeAndReel; Applications: RF, Microwave, High Frequency; Package / Case: 0402 (1005 Metric); ComponentLink1Description: Datasheet; Price: 0.02; ComponentLink2URL: https://www.digikey.com/en/products/detail/johanson-technology-inc/QSCF500Q0R3A1GV001T/1561513; Lifecycle Status: Active; Operating Temperature: -55°C ~ 125°C; Size / Dimension: 0.040" L x 0.020" W (1.02mm x 0.51mm); Mounting Type: Surface Mount, MLCC
C10C = C0402C222J3GEC7411: CAP CER 0402 2.2NF 25V C0G 5%; Manufacturer: KEMET; id: 4180; Value: 2200 pF; Temperature Coefficient: C0G, NP0; Part Number: C0402C222J3GEC7411; Supplier Part Number 1: 399-C0402C222J3GEC7411CT-ND; ComponentLink2Description: DigiKey Link; Features: Low ESL; ComponentLink1URL: https://api.kemet.com/component-edge/download/datasheet/C0402C222J3GEC7411.pdf; PartId: 33604; Tolerance: ±5%; Supplier 1: DigiKey; Series: ESD SMD Comm C0G; LastUpdated: 2023-01-03T20:03:34.670; Part Status: Active; Capacitance: 2200 pF; Device Package: 0402 (1005 Metric); Thickness (Max): 0.022" (0.55mm); Voltage - Rated: 25V; Minimum Order: 1; Packaging: TapeAndReel; Applications: ESD Protection; Package / Case: 0402 (1005 Metric); ComponentLink1Description: Datasheet; Price: 0.01; ComponentLink2URL: https://www.digikey.com/en/products/detail/kemet/C0402C222J3GEC7411/8645834; Lifecycle Status: Active; Operating Temperature: -55°C ~ 125°C; Size / Dimension: 0.039" L x 0.020" W (1.00mm x 0.50mm); Mounting Type: Surface Mount, MLCC
C11C = C0402C472K5RECAUTO: CAP CER 0402 4.7NF 50V X7R 10%; Manufacturer: KEMET; id: 3941; Value: 4700 pF; Part Number: C0402C472K5RECAUTO; Temperature Coefficient: X7R; Supplier Part Number 1: 399-C0402C472K5RECAUTOCT-ND; ComponentLink2Description: DigiKey Link; ComponentLink1URL: https://api.kemet.com/component-edge/download/datasheet/C0402C472K5RECAUTO.pdf; PartId: 33184; Tolerance: ±10%; Supplier 1: DigiKey; Series: ESD SMD Auto X7R; LastUpdated: 2023-01-03T20:03:32.387; Part Status: Active; Capacitance: 4700 pF; Device Package: 0402 (1005 Metric); Ratings: AEC-Q200; Thickness (Max): 0.022" (0.55mm); Voltage - Rated: 50V; Minimum Order: 1; Packaging: TapeAndReel; Applications: Automotive, ESD Protection; Package / Case: 0402 (1005 Metric); ComponentLink1Description: Datasheet; Price: 0.01; ComponentLink2URL: https://www.digikey.com/en/products/detail/kemet/C0402C472K5RECAUTO/8646475; Lifecycle Status: Active; Operating Temperature: -55°C ~ 125°C; Size / Dimension: 0.039" L x 0.020" W (1.00mm x 0.50mm); Mounting Type: Surface Mount, MLCC
C12C C13C = 0402N220J250CT: CAP CER 22PF 25V C0G/NP0 0402; Manufacturer: Walsin Technology Corporation; id: 507; Temperature Coefficient: C0G, NP0; Tolerance: ±5%; Part Number: 0402N220J250CT; Value: 22 pF; Supplier Part Number 1: 1292-1282-1-ND; ComponentLink2Description: DigiKey Link; ComponentLink1URL: http://www.passivecomponent.com/wp-content/uploads/2018/10/MLCC.pdf; PartId: 2676; Supplier 1: DigiKey; Series: -; LastUpdated: 2023-01-03T20:04:15.580; Part Status: Active; Capacitance: 22 pF; Device Package: 0402 (1005 Metric); Thickness (Max): 0.022" (0.55mm); Voltage - Rated: 25V; Minimum Order: 1; Packaging: CutTape; Applications: General Purpose; Package / Case: 0402 (1005 Metric); ComponentLink1Description: Datasheet; Price: 0.01; ComponentLink2URL: https://www.digikey.com/en/products/detail/walsin-technology-corporation/0402N220J250CT/9354779; Lifecycle Status: Active; Operating Temperature: -55°C ~ 125°C; Size / Dimension: 0.039" L x 0.020" W (1.00mm x 0.50mm); Mounting Type: Surface Mount, MLCC
EMS1C = SMS-255F: RF Shield Frame 0.750 (19.05mm) X 0.750 (19.05mm) - Surface Mount; MF: Leader Tech; SnapEDA_Link: https://www.snapeda.com/parts/SMS-255F/Leader+Tech+Inc./view-part/?ref=snap; Package: None; Value: *; MP: SMS-255F; Check_prices: https://www.snapeda.com/parts/SMS-255F/Leader+Tech+Inc./view-part/?ref=eda
FL1C = 2450LP14A100T: Filter; Manufacturer_Name: JOHANSON TECHNOLOGY; Datasheet Link: https://componentsearchengine.com/Datasheets/1/2450LP14A100T.pdf; Height: 0.7mm; Manufacturer_Part_Number: 2450LP14A100T; Mouser Part Number: 609-2450LP14A100T; Mouser Price/Stock: https://www.mouser.co.uk/ProductDetail/Johanson-Technology/2450LP14A100T?qs=yCnrNFeXz%252BgP94nTCDCKIA%3D%3D; Arrow Part Number: 2450LP14A100T; Arrow Price/Stock: https://www.arrow.com/en/products/2450lp14a100t/johanson-dielectrics?region=nac; Supplier 1: Mouser; Supplier Part Number 1: 609-2450LP14A100T
IC1C = NRF24L01P-R7: Integrated Circuit; Manufacturer_Name: Nordic Semiconductor; Datasheet Link: https://www.mouser.com/ds/2/297/nRF24L01P-1187709.pdf; Height: 0.95mm; Manufacturer_Part_Number: NRF24L01P-R7; Mouser Part Number: 949-NRF24L01P-R7; Mouser Price/Stock: https://www.mouser.co.uk/ProductDetail/Nordic-Semiconductor/nRF24L01P-R7?qs=yd0qOhnSiDe8zMRXiZkGiQ%3D%3D; Arrow Part Number: NRF24L01P-R7; Arrow Price/Stock: null?region=nac; Supplier 1: Avnet; Supplier Part Number 1: NRF24L01P-R7
L1C = LQW18AS3N9G0ZD: FIXED IND 3.9NH 700MA 80 MOHM; Manufacturer: Murata Electronics; id: 1055; Frequency - Self Resonant: 6.9GHz; Tolerance: ±2%; Type: Wirewound; Inductance Frequency - Test: 250MHz; Q @ Freq: 22 @ 250MHz; Material - Core: Non-Magnetic; DC Resistance (DCR): 80mOhm Max; Shielding: Unshielded; Part Number: LQW18AS3N9G0ZD; Height - Seated (Max): 0.039" (1.00mm); Supplier Part Number 1: 490-15828-1-ND; Current Rating (Amps): 700mA; Supplier Device Package: 0603 (1608 Metric); Inductance: 3.9nH; ComponentLink1Description: Datasheet; ComponentLink2URL: http://digikey.com/product-detail/en/murata-electronics/LQW18AS3N9G0ZD/490-15828-1-ND/6800493; ComponentLink1URL: https://search.murata.co.jp/Ceramy/image/img/P02/JELF243A-9139.pdf; Supplier 1: DigiKey; Series: LQW18; Part Status: Active; ComponentLink2Description: DigiKey Link; Device Package: 0603 (1608 Metric); Packaging: TapeAndReel; Ratings: AEC-Q200; Minimum Order: 1; Package / Case: 0603 (1608 Metric); PartId: 1055; Lifecycle Status: Active; LastUpdated: 2020-09-06T11:05:18.113; Operating Temperature: -55°C ~ 125°C; Value: 3.9nH; Size / Dimension: 0.063" L x 0.031" W (1.60mm x 0.80mm); Mounting Type: Surface Mount; Price: 0.08
L2C = LQW18AS8N2G0ZD: FIXED IND 8.2NH 700MA 115 MOHM; Manufacturer: Murata Electronics; id: 999; Frequency - Self Resonant: 4.2GHz; Tolerance: ±2%; Type: Wirewound; Inductance Frequency - Test: 250MHz; Q @ Freq: 30 @ 250MHz; Material - Core: Non-Magnetic; DC Resistance (DCR): 115mOhm Max; Shielding: Unshielded; Part Number: LQW18AS8N2G0ZD; Height - Seated (Max): 0.039" (1.00mm); Supplier Part Number 1: 490-15856-1-ND; Current Rating (Amps): 700mA; Supplier Device Package: 0603 (1608 Metric); Inductance: 8.2nH; ComponentLink1Description: Datasheet; ComponentLink2URL: http://digikey.com/product-detail/en/murata-electronics/LQW18AS8N2G0ZD/490-15856-1-ND/6800521; ComponentLink1URL: https://search.murata.co.jp/Ceramy/image/img/P02/JELF243A-9139.pdf; Supplier 1: DigiKey; Series: LQW18; Part Status: Active; ComponentLink2Description: DigiKey Link; Device Package: 0603 (1608 Metric); Packaging: TapeAndReel; Ratings: AEC-Q200; Minimum Order: 1; Package / Case: 0603 (1608 Metric); PartId: 999; Lifecycle Status: Active; LastUpdated: 2020-09-06T11:05:17.697; Operating Temperature: -55°C ~ 125°C; Value: 8.2nH; Size / Dimension: 0.063" L x 0.031" W (1.60mm x 0.80mm); Mounting Type: Surface Mount; Price: 0.08
L3C = LQW15AN2N7G8ZD: FIXED IND 2.7NH 1.5A 47MOHM SMD; Manufacturer: Murata Electronics; id: 106; Frequency - Self Resonant: 14GHz; Tolerance: ±2%; Type: Wirewound; Inductance Frequency - Test: 100 MHz; Q @ Freq: 28 @ 250MHz; Material - Core: Non-Magnetic; DC Resistance (DCR): 47mOhm Max; Shielding: Unshielded; Part Number: LQW15AN2N7G8ZD; Height - Seated (Max): 0.024" (0.60mm); Supplier Part Number 1: 490-15398-1-ND; Current Rating (Amps): 1.5 A; Supplier Device Package: 0402 (1005 Metric); Inductance: 2.7 nH; ComponentLink1Description: Datasheet; ComponentLink2URL: https://www.digikey.com/en/products/detail/murata-electronics/LQW15AN2N7G8ZD/6798823; ComponentLink1URL: https://search.murata.co.jp/Ceramy/image/img/P02/JELF243A-9138.pdf; Supplier 1: DigiKey; Series: LQW15; Part Status: Active; ComponentLink2Description: DigiKey Link; Device Package: 0402 (1005 Metric); Packaging: TapeAndReel; Ratings: AEC-Q200; Minimum Order: 1; Package / Case: 0402 (1005 Metric); PartId: 106; Lifecycle Status: Active; LastUpdated: 2023-01-02T20:59:33.170; Operating Temperature: -55°C ~ 125°C; Value: 2.7 nH; Size / Dimension: 0.039" L x 0.024" W (1.00mm x 0.60mm); Mounting Type: Surface Mount; Price: 0.07
L4C L5C = LQW15AN2N4G80D: FIXED IND 2.4NH 2.53A 22MOHM SMD; Manufacturer: Murata Electronics; id: 1601; Frequency - Self Resonant: 15.5GHz; Tolerance: ±2%; Type: Wirewound; Inductance Frequency - Test: 100 MHz; Q @ Freq: 30 @ 250MHz; Material - Core: Non-Magnetic; DC Resistance (DCR): 22mOhm Max; Shielding: Unshielded; Part Number: LQW15AN2N4G80D; Height - Seated (Max): 0.024" (0.60mm); Supplier Part Number 1: 490-LQW15AN2N4G80DCT-ND; Current Rating (Amps): 2.53 A; Supplier Device Package: 0402; Inductance: 2.4 nH; ComponentLink1Description: Datasheet; ComponentLink2URL: https://www.digikey.com/en/products/detail/murata-electronics/LQW15AN2N4G80D/9815978; ComponentLink1URL: https://search.murata.co.jp/Ceramy/image/img/P02/JELF243A-0100.pdf; Supplier 1: DigiKey; Series: LQW15; Part Status: Active; ComponentLink2Description: DigiKey Link; Device Package: 0402 (1005 Metric); Packaging: TapeAndReel; Ratings: AEC-Q200; Minimum Order: 1; Package / Case: 0402 (1005 Metric); PartId: 1601; Lifecycle Status: Active; LastUpdated: 2023-04-30T20:10:30.157; Operating Temperature: -55°C ~ 125°C; Value: 2.4 nH; Size / Dimension: 0.039" L x 0.024" W (1.00mm x 0.60mm); Mounting Type: Surface Mount; Price: 0.07
R1C = AC0402FR-1322KL: RES 22K OHM 1% 1/16W 0402; Manufacturer: Yageo; id: 12344; Temperature Coefficient: ±100ppm/°C; Power (Watts): 0.063W, 1/16W; Part Number: AC0402FR-1322KL; Height - Seated (Max): 0.015" (0.37mm); Supplier Part Number 1: 13-AC0402FR-1322KLCT-ND; Supplier Device Package: 0402; ComponentLink1Description: Datasheet; ComponentLink2URL: https://www.digikey.com/en/products/detail/yageo/AC0402FR-1322KL/14008249; ComponentLink1URL: https://www.yageo.com/upload/media/product/productsearch/datasheet/rchip/PYu-AC_51_RoHS_L_8.pdf; Composition: Thick Film; Tolerance: ±1%; Supplier 1: DigiKey; Series: AC; Part Status: Active; ComponentLink2Description: DigiKey Link; Device Package: 0402 (1005 Metric); Packaging: CutTape; Ratings: AEC-Q200; Minimum Order: 1; Package / Case: 0402 (1005 Metric); PartId: 65198; Lifecycle Status: Active; LastUpdated: 2023-01-02T20:20:07.897; Operating Temperature: -55°C ~ 155°C; Number Of Terminations: 2; Value: 22 kOhms; Size / Dimension: 0.039" L x 0.020" W (1.00mm x 0.50mm); Price: 0.01; Resistance: 22 kOhms
R2C R3C = AC0402FR-1310KL: RES 10K OHM 1% 1/16W 0402; Manufacturer: Yageo; id: 13132; Temperature Coefficient: ±100ppm/°C; Power (Watts): 0.063W, 1/16W; Part Number: AC0402FR-1310KL; Height - Seated (Max): 0.015" (0.37mm); Supplier Part Number 1: 13-AC0402FR-1310KLCT-ND; Supplier Device Package: 0402; ComponentLink1Description: Datasheet; ComponentLink2URL: https://www.digikey.com/en/products/detail/yageo/AC0402FR-1310KL/12756397; Features: Automotive AEC-Q200, Moisture Resistant; ComponentLink1URL: https://www.yageo.com/upload/media/product/productsearch/datasheet/rchip/PYu-AC_51_RoHS_L_8.pdf; Composition: Thick Film; Tolerance: ±1%; Supplier 1: DigiKey; Series: AC; Part Status: Active; ComponentLink2Description: DigiKey Link; Device Package: 0402 (1005 Metric); Packaging: CutTape; Ratings: AEC-Q200; Minimum Order: 1; Package / Case: 0402 (1005 Metric); PartId: 69220; Lifecycle Status: Active; LastUpdated: 2023-01-02T20:19:54.633; Operating Temperature: -55°C ~ 155°C; Number Of Terminations: 2; Value: 10 kOhms; Size / Dimension: 0.039" L x 0.020" W (1.00mm x 0.50mm); Price: 0.01; Resistance: 10 kOhms
R4C = AC0402FR-071ML: as R1E on sheet Debug; Part Number: AC0402FR-071ML; Height - Seated (Max): 0.015" (0.37mm); Supplier Part Number 1: YAG3450CT-ND; Supplier Device Package: 0402; ComponentLink1Description: Datasheet; ComponentLink2URL: https://www.digikey.com/en/products/detail/yageo/AC0402FR-071ML/5895164; Features: Automotive AEC-Q200, Moisture Resistant; ComponentLink1URL: https://www.yageo.com/upload/media/product/productsearch/datasheet/rchip/PYu-AC_51_RoHS_L_7.pdf; Composition: Thick Film; Tolerance: ±1%; Supplier 1: DigiKey; Series: AC; Part Status: Active; ComponentLink2Description: DigiKey Link; Device Package: 0402 (1005 Metric); Packaging: CutTape; Ratings: AEC-Q200; Minimum Order: 1; Package / Case: 0402 (1005 Metric); PartId: 12043; Lifecycle Status: Active; LastUpdated: 2023-01-02T20:21:09.883; Operating Temperature: -55°C ~ 155°C; Number Of Terminations: 2; Value: 1 MOhms; Size / Dimension: 0.039" L x 0.020" W (1.00mm x 0.50mm); Price: 0.01; Resistance: 1 MOhms
U1C = RFX2401C: No Description Available; Mfr_Name: Skyworks; RefDes: RefDes; Type: Type
U2C = CMP-07128-000006-2: IC REG LINEAR 3.3V 500MA 6WDFN; Number of Outputs: 1; Min Input Voltage: 2.5V; Accuracy: 2%; Min Current Limit: 510mA; Polarity: Positive; Output Type: Fixed; Quiescent Current: 25uA; Dropout Voltage: 230mV; Max Input Voltage: 5.5V; Number of Pins: 6; Mount: Surface Mount; Package Quantity: 3000; Lead Free: Lead Free; Radiation Hardening: No; Min Operating Temperature: -40°C; Number of Regulators: 1; Max Operating Temperature: 125°C; Output Current: 500mA; Max Output Current: 500mA; Packaging: Tape and Reel; Output Voltage: 3.3V
Y1C = NX2520SA-16MHZ-EXS00A-CS05116: CRYSTAL 16.0000MHZ 12PF SMD; Manufacturer: NDK America, Inc.; id: 522; Frequency Tolerance: ±15ppm; Operating Mode: Fundamental; Esr (Equivalent Series Resistance): 80 Ohms; Part Number: NX2520SA-16MHZ-EXS00A-CS05116; Height - Seated (Max): 0.022" (0.55mm); Supplier Part Number 1: 644-1200-1-ND; ComponentLink1Description: Datasheet; ComponentLink2URL: https://www.digikey.com/en/products/detail/ndk-america-inc/NX2520SA-16MHZ-EXS00A-CS05116/3894065; ComponentLink1URL: //media.digikey.com/pdf/Data%20Sheets/NDK%20PDFs/NX2520SA-16MHZ-EXS00A-CS05116.pdf; Supplier 1: DigiKey; Frequency: 16 MHz; Series: NX2520SA; Part Status: Active; Type: MHz Crystal; ComponentLink2Description: DigiKey Link; Packaging: TapeAndReel; Frequency Stability: ±15ppm; Minimum Order: 1; Package / Case: 4-SMD, No Lead; PartId: 522; Lifecycle Status: Active; LastUpdated: 2023-01-02T20:58:22.490; Operating Temperature: -10°C ~ 75°C; Value: 16 MHz; Size / Dimension: 0.098" L x 0.079" W (2.50mm x 2.00mm); Mounting Type: Surface Mount; Price: 0.74; Load Capacitance: 12pF